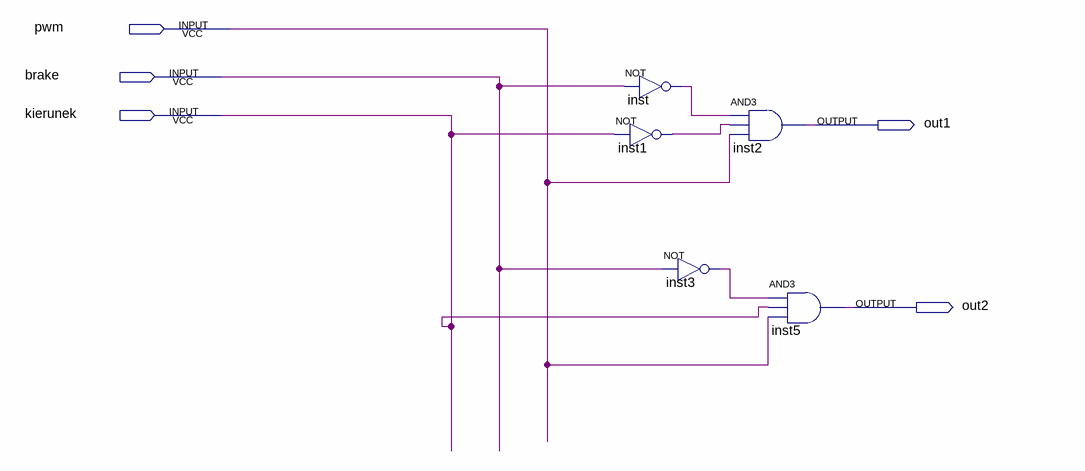
[diagram p0: schematic sheet]
// Quartus schematic dcmc.bdf as structural Verilog: 5 symbols, 5 pins
module dcmc (
  input  pwm,
  input  brake,
  input  kierunek,
  output out1,
  output out2
);

  wire inst1_out, inst3_out, inst_out;

  not inst (inst_out, brake);
  not inst1 (inst1_out, kierunek);
  not inst3 (inst3_out, brake);
  and inst2 (out1, inst_out, inst1_out, pwm);
  and inst5 (out2, inst3_out, kierunek, pwm);
endmodule
